# EAGLE design MAX3421E-breakout (EAGLE 5.10)
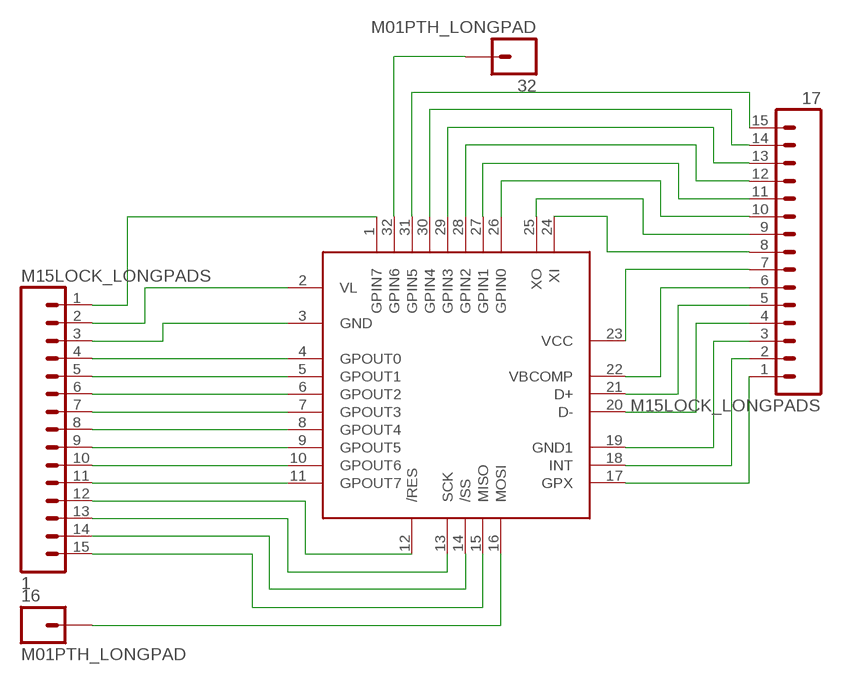
[diagram p0: schematic, sheet 1]

## Parts
1  M15LOCK_LONGPADS  [1X15_LOCK_LONGPADS]
16  M01PTH_LONGPAD  [1X01_LONGPAD]
17  M15LOCK_LONGPADS  [1X15_LOCK_LONGPADS]
32  M01PTH_LONGPAD  [1X01_LONGPAD]
U$1  MAX3421E  [TQFP32-08]

## Nets
17: 17.1 U$1.17(GPX)
32: 32.1 U$1.32(GPIN6)
GND: 1.3 17.3 U$1.3(GND) U$1.19(GND1)
N$1: 1.1 U$1.1(GPIN7)
N$2: 1.2 U$1.2(VL)
N$4: 1.4 U$1.4(GPOUT0)
N$5: 1.5 U$1.5(GPOUT1)
N$6: 1.6 U$1.6(GPOUT2)
N$7: 1.7 U$1.7(GPOUT3)
N$8: 1.8 U$1.8(GPOUT4)
N$9: 1.9 U$1.9(GPOUT5)
N$10: 1.10 U$1.10(GPOUT6)
N$11: 1.11 U$1.11(GPOUT7)
N$12: 1.12 U$1.12(/RES)
N$13: 1.13 U$1.13(SCK)
N$14: 1.14 U$1.14(/SS)
N$15: 1.15 U$1.15(MISO)
N$16: 16.1 U$1.16(MOSI)
N$18: 17.2 U$1.18(INT)
N$20: 17.4 U$1.20(D-)
N$21: 17.5 U$1.21(D+)
N$22: 17.6 U$1.22(VBCOMP)
N$23: 17.7 U$1.23(VCC)
N$25: 17.15 U$1.31(GPIN5)
N$26: 17.14 U$1.30(GPIN4)
N$27: 17.13 U$1.29(GPIN3)
N$28: 17.12 U$1.28(GPIN2)
N$29: 17.11 U$1.27(GPIN1)
N$30: 17.10 U$1.26(GPIN0)
N$31: 17.9 U$1.25(XO)
N$32: 17.8 U$1.24(XI)

## Library data of the parts
1 17 = SparkFun:M15: Header 15 Standard 15-pin 0.1" header. Use with straight break away headers (SKU : PRT-00116), right angle break away headers (PRT-00553), swiss pins (PRT-00743), machine pins (PRT-00117), and female headers (PRT-00115).
16 32 = SparkFun:M01: Header 1 Standard 1-pin 0.1" header. Use with straight break away headers (SKU : PRT-00116), right angle break away headers (PRT-00553), swiss pins (PRT-00743), machine pins (PRT-00117), and female headers (PRT-00115).
U$1 = ideabot:MAX3421E

## Board
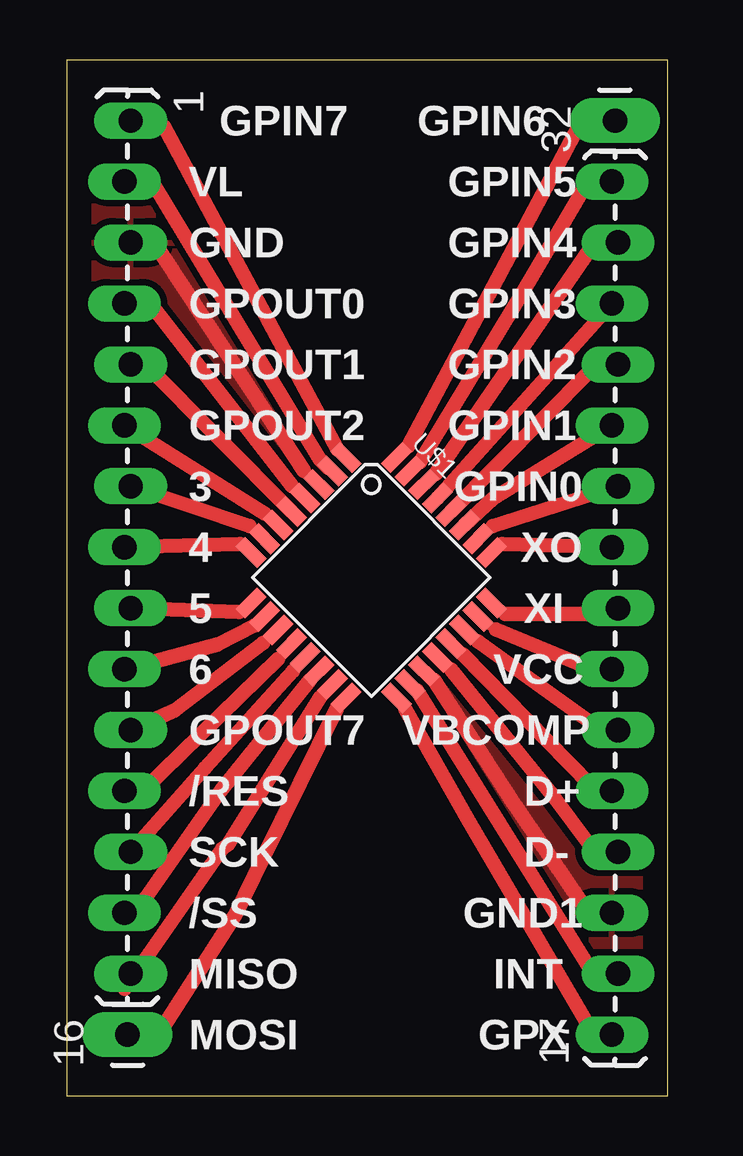
[diagram p1: board, top side]

Size 25.07 x 43.17 mm. Coordinates in mm from the lower left corner, seen from the top.
Outline: 0,0 25.07,0 25.07,43.17 0,43.17 0,0
Copper layers (1*16): Top 0.035mm / dielectric 1.5mm / Bottom 0.035mm
Design rules "default": minimum track width 10mil, minimum drill 24mil, track to track 8mil, track to pad 8mil, pad to pad 8mil, via to via 8mil, smd to smd 8mil, copper to edge 40mil, drill to drill 8mil, minimum pad ring 10mil, minimum via ring 8mil, stop-mask expansion 4mil, vias tented up to drill 0mil, thermal gap 10mil

### Footprints (pad centres in the part's own frame; a part is rotated, then mirrored left to right if it is on the bottom)
1X15_LOCK_LONGPADS = drill 1.016 long: 1 0,0.127; 2 2.54,-0.127; 3 5.08,0.127; 4 7.62,-0.127; 5 10.16,0.127; 6 12.7,-0.127; 7 15.24,0.127; 8 17.78,-0.127; 9 20.32,0.127; 10 22.86,-0.127; 11 25.4,0.127; 12 27.94,-0.127; 13 30.48,0.127; 14 33.02,-0.127; 15 35.56,0.127
1X01_LONGPAD = drill 1.016 pad 1.88 long: 1 0,0
TQFP32-08 = smd 1.27 x 0.559: 1 -4.293,2.8; 2 -4.293,2; 3 -4.293,1.2; 4 -4.293,0.4; 5 -4.293,-0.4; 6 -4.293,-1.2; 7 -4.293,-2; 8 -4.293,-2.8; 17 4.293,-2.8; 18 4.293,-2; 19 4.293,-1.2; 20 4.293,-0.4; 21 4.293,0.4; 22 4.293,1.2; 23 4.293,2; 24 4.293,2.8 | smd 0.559 x 1.27: 9 -2.8,-4.293; 10 -2,-4.293; 11 -1.2,-4.293; 12 -0.4,-4.293; 13 0.4,-4.293; 14 1.2,-4.293; 15 2,-4.293; 16 2.8,-4.293; 25 2.8,4.293; 26 2,4.293; 27 1.2,4.293; 28 0.4,4.293; 29 -0.4,4.293; 30 -1.2,4.293; 31 -2,4.293; 32 -2.8,4.293

### Placement (x,y rotation side)
1  2.54,40.64 270 top
16  2.54,2.54 90 top
17  22.86,2.54 90 top
32  22.86,40.64 90 top
U$1  12.7,21.59 315 top

### Tracks (layer width: path | path; a pad name or v marks a point on that pad's centre or on a via)
17
  Top 0.406: 14.14,16.09 U$1.17 | 21.84,2.79 22.48,2.79 17.1
  Top 0.61: 14.14,16.09 16.76,11.43 21.84,2.79
32
  Top 0.406: U$1.32 13.78,26.6 14.22,27.05 | 21.34,40.39 32.1
  Top 0.61: 14.22,27.05 21.34,40.39
GND
  Top 0.406: U$1.3 10.26,25.68 9.91,26.04 | 3.81,35.31 1.3 | 15.31,17.32 U$1.19 | 21.59,7.87 22.48,7.87 17.3
  Top 0.61: 9.91,26.04 3.81,35.31 | 15.31,17.32 18.54,12.32 21.59,7.87
  pour Top (isolate 0.254): 0.13,43.05 25.02,42.93 25.02,-0.13 0.13,0
N$1
  Top 0.254: U$1.1 11.62,26.6
  Top 0.406: 4.06,40.39 1.1 | 11.62,26.6 11.3,26.92 11.62,26.6
  Top 0.61: 11.3,26.92 4.06,40.39
N$2
  Top 0.406: U$1.2 10.92,26.17 | 3.56,38.1 1.2
  Top 0.61: 10.92,26.17 10.54,26.54 3.56,38.1
N$4
  Top 0.406: 9.4,25.4 9.89,24.91 U$1.4 | 1.4 3.3,33.27
  Top 0.61: 3.3,33.27 9.4,25.4
N$5
  Top 0.406: 3.3,30.48 1.5
  Top 0.61: U$1.5 3.3,30.48
N$6
  Top 0.254: 8.73,23.78 U$1.6
  Top 0.406: 8.26,24.26 8.73,23.78
  Top 0.61: 1.6 8.26,24.26
N$7
  Top 0.406: 7.62,23.75 U$1.7
  Top 0.61: 1.7 7.62,23.75
N$8
  Top 0.406: 7.24,22.99 U$1.8
  Top 0.61: 1.8 7.24,22.99
N$9
  Top 0.406: 7.2,20.15 U$1.9
  Top 0.61: 1.9 7.2,20.15
N$10
  Top 0.406: 7.84,19.59 U$1.10 | 1.10 3.43,18.03
  Top 0.61: 7.84,19.59 6.29,18.8 3.43,18.03
N$11
  Top 0.406: U$1.11 8.86,19.4 8.19,18.86
  Top 0.61: 8.19,18.86 4.51,16.07 1.11
N$12
  Top 0.406: 8.8,18.2 U$1.12 | 1.12 3.18,12.7
  Top 0.61: 3.18,12.7 8.8,18.2
N$13
  Top 0.406: 9.44,17.69 U$1.13
  Top 0.61: 9.44,17.69 5.78,13.65 1.13
N$14
  Top 0.406: 10.15,17.32 U$1.14 | 1.14 2.86,7.62
  Top 0.61: 10.15,17.32 6.41,12.7 2.86,7.62
N$15
  Top 0.406: 10.57,16.6 U$1.15 | 2.41,4.45 1.15
  Top 0.61: 10.57,16.6 6.73,10.48 6.48,10.29 2.41,4.45
N$16
  Top 0.406: 11.26,16.15 U$1.16 | 16.1 3.81,2.54
  Top 0.61: 11.26,16.15 8.19,9.91 7.05,7.56 3.81,2.54
N$18
  Top 0.406: U$1.18 14.36,17.14 14.6,16.89 | 22.1,4.83 22.73,4.83 17.2
  Top 0.61: 22.1,4.83 14.6,16.89
N$20
  Top 0.406: 16.02,17.76 U$1.20 | 21.84,10.41 22.73,10.41 17.4
  Top 0.61: 16.02,17.76 20.32,12.45 21.84,10.41
N$21
  Top 0.406: 16.53,18.4 U$1.21 | 21.84,12.95 22.48,12.95 17.5
  Top 0.61: 21.84,12.95 16.53,18.4
N$22
  Top 0.406: U$1.22 16.66,19.28 17.15,18.92 | 22.1,15.37 17.6
  Top 0.61: 17.15,18.92 22.1,15.37
N$23
  Top 0.406: U$1.23 17.15,19.93 17.91,19.43 | 22.48,17.53 17.7
  Top 0.61: 17.91,19.43 22.48,17.53
N$25
  Top 0.406: U$1.31 14.36,26.04 14.73,26.42 | 21.59,37.85 17.15
  Top 0.61: 14.73,26.42 19.05,33.53 21.59,37.85
N$26
  Top 0.406: U$1.30 14.93,25.47 15.37,25.91 | 21.84,35.31 17.14
  Top 0.61: 15.37,25.91 21.84,35.31
N$27
  Top 0.61: U$1.29 17.13
N$28
  Top 0.406: 21.84,30.23 17.12
  Top 0.61: U$1.28 21.84,30.23
N$29
  Top 0.61: U$1.27 17.78,24.89 17.11
N$30
  Top 0.406: U$1.26 17.78,23.75
  Top 0.61: 17.78,23.75 17.10
N$31
  Top 0.406: U$1.25 18.16,22.99
  Top 0.61: 18.16,22.99 17.9
N$32
  Top 0.406: U$1.24 17.82,20.53 18.29,20.07 | 22.35,20.07 17.8
  Top 0.61: 18.29,20.07 22.35,20.07

### Text on the board
tPlace: GPIN7 | GPIN6 | VL | GPIN5 | GND | GPIN4 | GPOUT0 | GPIN3 | GPOUT1 | GPIN2 | GPOUT2 | GPIN1 | 3 | GPIN0 | 4 | XO | 5 | XI | 6 | VCC | GPOUT7 | VBCOMP | /RES | D+ | SCK | D- | /SS | GND1 | MISO | INT | MOSI | GPX